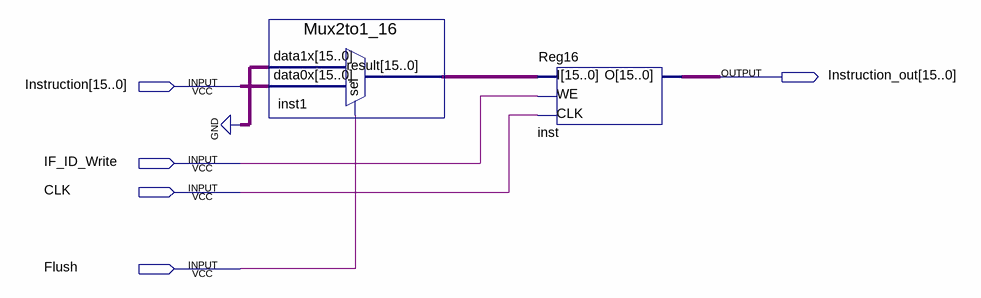
[diagram p0: schematic sheet]
// Quartus schematic IF_ID.bdf as structural Verilog: 2 symbols, 5 pins
module IF_ID (
  input  [15:0] Instruction,
  input  IF_ID_Write,
  input  CLK,
  input  Flush,
  output [15:0] Instruction_out
);

  wire [15:0] inst1_result;

  Mux2to1_16 inst1 (.data1x({16{1'b0}}), .data0x(Instruction), .sel(Flush), .result(inst1_result));
  Reg16 inst (.WE(IF_ID_Write), .CLK(CLK), .I(inst1_result), .O(Instruction_out));
endmodule
